# Altium schematic sheet C-metr_digital.SchDoc
size 500 x 350 mm
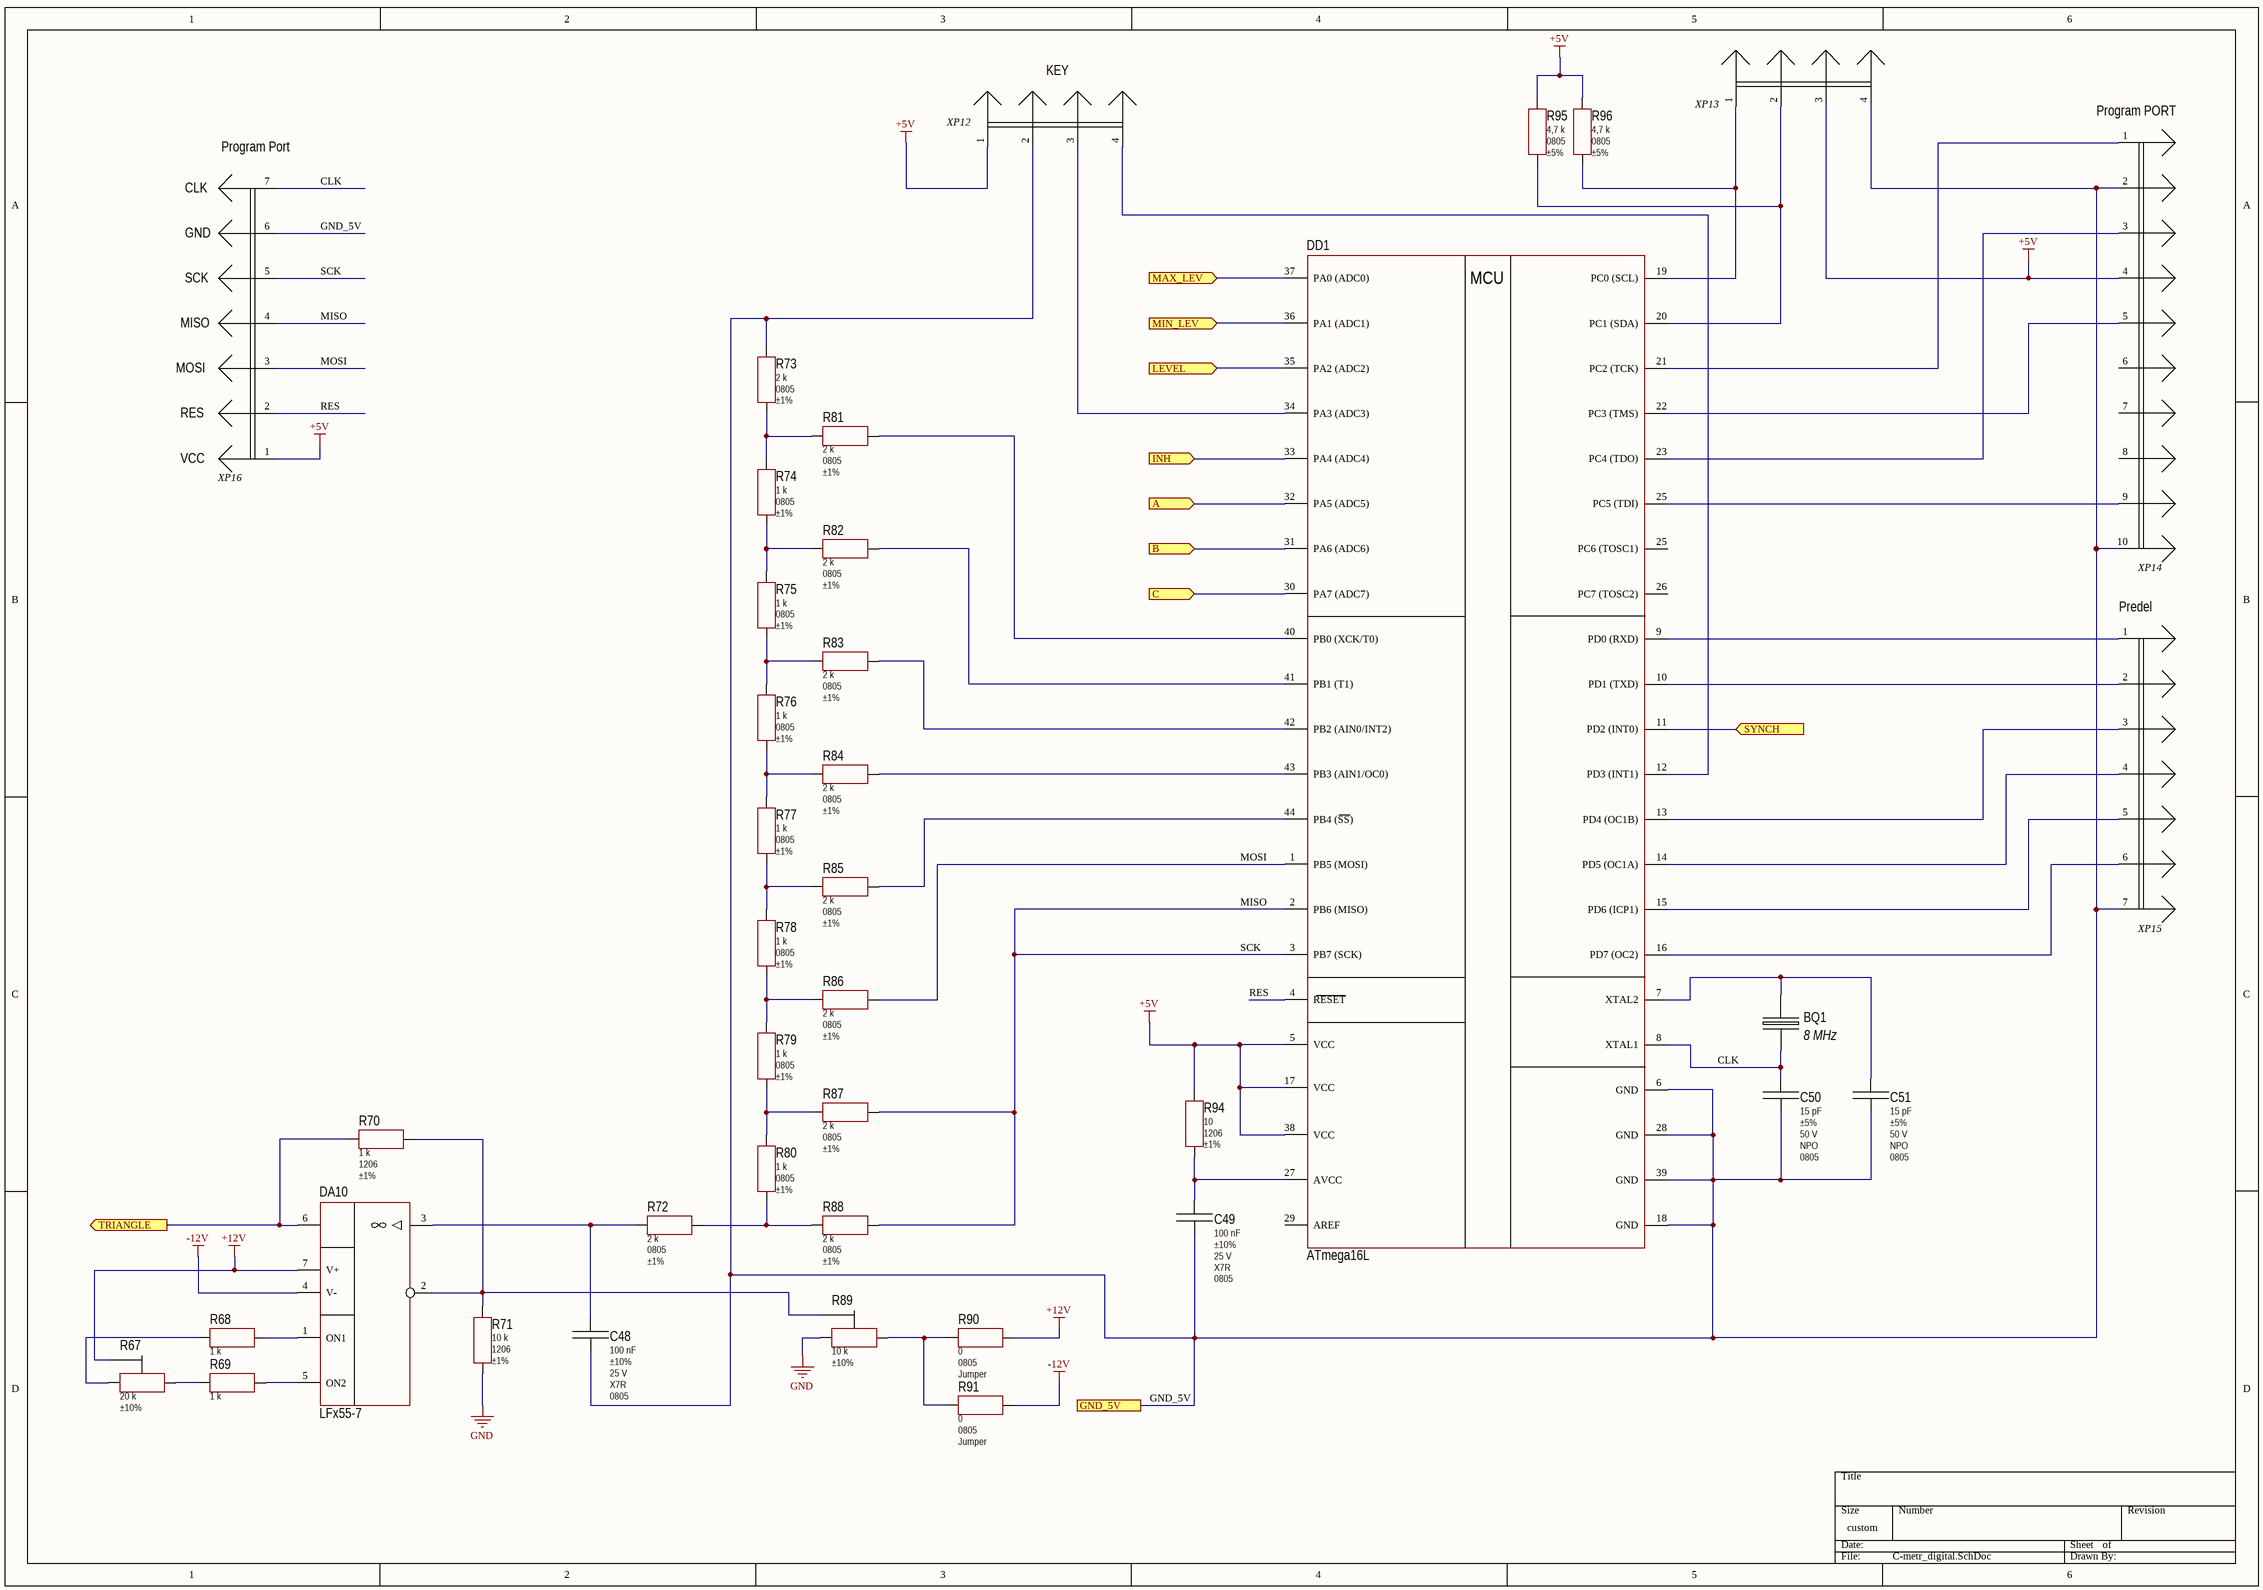
[diagram p0: C-metr_digital.SchDoc]

## Parts
BQ1  8 MHz  [HC-49/U3H]
C48  Tolerance: ±10%  Voltage: 25 V  Dielectric: X7R  Case: 0805  [C-0805-0.95]  (hidden comment: 100 nF)
C49  Tolerance: ±10%  Voltage: 25 V  Dielectric: X7R  Case: 0805  [C-0805-0.95]  (hidden comment: 100 nF)
C50  Tolerance: ±5%  Voltage: 50 V  Dielectric: NPO  Case: 0805  [C-0805-0.7]  (hidden comment: 15 pF)
C51  Tolerance: ±5%  Voltage: 50 V  Dielectric: NPO  Case: 0805  [C-0805-0.7]  (hidden comment: 15 pF)
DA10  LFx55-7  [DIP-8]
DD1  ATmega16L  [TQFP-44]
R67  Tolerance: ±10%  [3296W]  (hidden comment: 20 k)
R68  1 k  [R-1206]
R69  1 k  [R-1206]
R70  Case: 1206  Tolerance: ±1%  [R-1206]  (hidden comment: 1 k)
R71  Case: 1206  Tolerance: ±1%  [R-1206]  (hidden comment: 10 k)
R72  Case: 0805  Tolerance: ±1%  [R-0805]  (hidden comment: 2 k)
R73  Case: 0805  Tolerance: ±1%  [R-0805]  (hidden comment: 2 k)
R74  Case: 0805  Tolerance: ±1%  [R-0805]  (hidden comment: 1 k)
R75  Case: 0805  Tolerance: ±1%  [R-0805]  (hidden comment: 1 k)
R76  Case: 0805  Tolerance: ±1%  [R-0805]  (hidden comment: 1 k)
R77  Case: 0805  Tolerance: ±1%  [R-0805]  (hidden comment: 1 k)
R78  Case: 0805  Tolerance: ±1%  [R-0805]  (hidden comment: 1 k)
R79  Case: 0805  Tolerance: ±1%  [R-0805]  (hidden comment: 1 k)
R80  Case: 0805  Tolerance: ±1%  [R-0805]  (hidden comment: 1 k)
R81  Case: 0805  Tolerance: ±1%  [R-0805]  (hidden comment: 2 k)
R82  Case: 0805  Tolerance: ±1%  [R-0805]  (hidden comment: 2 k)
R83  Case: 0805  Tolerance: ±1%  [R-0805]  (hidden comment: 2 k)
R84  Case: 0805  Tolerance: ±1%  [R-0805]  (hidden comment: 2 k)
R85  Case: 0805  Tolerance: ±1%  [R-0805]  (hidden comment: 2 k)
R86  Case: 0805  Tolerance: ±1%  [R-0805]  (hidden comment: 2 k)
R87  Case: 0805  Tolerance: ±1%  [R-0805]  (hidden comment: 2 k)
R88  Case: 0805  Tolerance: ±1%  [R-0805]  (hidden comment: 2 k)
R89  Tolerance: ±10%  [3296W]  (hidden comment: 10 k)
R90  Case: 0805  Tolerance: Jumper  [R-0805]  (hidden comment: 0)
R91  Case: 0805  Tolerance: Jumper  [R-0805]  (hidden comment: 0)
R94  Case: 1206  Tolerance: ±1%  [R-1206]  (hidden comment: 10)
R95  Case: 0805  Tolerance: ±5%  [R-0805]  (hidden comment: 4,7 k)
R96  Case: 0805  Tolerance: ±5%  [R-0805]  (hidden comment: 4,7 k)
XP12  Text  [61300411121]  (value not drawn)
XP13  Text  [61300411121]  (value not drawn)
XP14  Text  [61201021621]  (value not drawn)
XP15  Text  [61300711121]  (value not drawn)
XP16  Text  [61300711121]  (value not drawn)

## Ports
A (in), B (in), C (in), GND_5V, INH (in), LEVEL (in), MAX_LEV (in), MIN_LEV (in), SYNCH (in), TRIANGLE (out)

## Nets
+5V: DD1.5(VCC) DD1.17(VCC) DD1.38(VCC) R94.2 R95.2 R96.2 XP12.1 XP13.3 XP14.4 XP16.1
+12V: DA10.7(V+) R67.2 R90.1
-12V: DA10.4(V-) R91.1
GND: R71.1 R89.3
A: DD1.32(PA5_(ADC5)) ; port A
B: DD1.31(PA6_(ADC6)) ; port B
C: DD1.30(PA7_(ADC7)) ; port C
CLK: BQ1.1 C50.2 DD1.8(XTAL1) XP16.7
GND_5V: C48.1 C49.1 C50.1 C51.1 DD1.6(GND) DD1.18(GND) DD1.28(GND) DD1.39(GND) R73.1 XP12.2 XP13.4 XP14.2 XP14.10 XP15.7 XP16.6 ; port GND_5V
INH: DD1.33(PA4_(ADC4)) ; port INH
LEVEL: DD1.35(PA2_(ADC2)) ; port LEVEL
MAX_LEV: DD1.37(PA0_(ADC0)) ; port MAX_LEV
MIN_LEV: DD1.36(PA1_(ADC1)) ; port MIN_LEV
MISO: DD1.2(PB6_(MISO)) DD1.3(PB7_(SCK)) R87.2 R88.2 XP16.4 XP16.5  [also labelled SCK]
MOSI: DD1.1(PB5_(MOSI)) R86.2 XP16.3
RES: DD1.4(RESET) XP16.2
SYNCH: DD1.11(PD2_(INT0)) ; port SYNCH
TRIANGLE: DA10.6(OUT) R70.1 ; port TRIANGLE
NetBQ1_2: BQ1.2 C51.2 DD1.7(XTAL2)
NetC48_2: C48.2 DA10.3(+IN) R72.1
NetC49_2: C49.2 DD1.27(AVCC) R94.1
NetDA10_1: DA10.1(ON1) R68.1
NetDA10_2: DA10.2(-IN) R70.2 R71.2 R89.2
NetDA10_5: DA10.5(ON2) R69.1
NetDD1_9: DD1.9(PD0_(RXD)) XP15.1
NetDD1_10: DD1.10(PD1_(TXD)) XP15.2
NetDD1_12: DD1.12(PD3_(INT1)) XP12.4
NetDD1_13: DD1.13(PD4_(OC1B)) XP15.3
NetDD1_14: DD1.14(PD5_(OC1A)) XP15.4
NetDD1_15: DD1.15(PD6_(ICP1)) XP15.5
NetDD1_16: DD1.16(PD7_(OC2)) XP15.6
NetDD1_19: DD1.19(PC0_(SCL)) R96.1 XP13.1
NetDD1_20: DD1.20(PC1_(SDA)) R95.1 XP13.2
NetDD1_21: DD1.21(PC2_(TCK)) XP14.1
NetDD1_22: DD1.22(PC3_(TMS)) XP14.5
NetDD1_23: DD1.23(PC4_(TDO)) XP14.3
NetDD1_25: DD1.25(PC6_(TOSC1)) XP14.9
NetDD1_34: DD1.34(PA3_(ADC3)) XP12.3
NetDD1_40: DD1.40(PB0_(XCK/T0)) R81.2
NetDD1_41: DD1.41(PB1_(T1)) R82.2
NetDD1_42: DD1.42(PB2_(AIN0/INT2)) R83.2
NetDD1_43: DD1.43(PB3_(AIN1/OC0)) R84.2
NetDD1_44: DD1.44(PB4_(SS)) R85.2
NetR67_1: R67.1 R69.2
NetR67_3: R67.3 R68.2
NetR72_2: R72.2 R80.1 R88.1
NetR73_2: R73.2 R74.2 R81.1
NetR74_1: R74.1 R75.2 R82.1
NetR75_1: R75.1 R76.2 R83.1
NetR76_1: R76.1 R77.2 R84.1
NetR77_1: R77.1 R78.2 R85.1
NetR78_1: R78.1 R79.2 R86.1
NetR79_1: R79.1 R80.2 R87.1
NetR89_1: R89.1 R90.2 R91.2

Not connected (* = marked no-connect by the designer): DD1 26(PC7_(TOSC2)) 29(AREF); XP14 6 7 8

## Notes on the sheet
- (near XP12) KEY
- (near XP14) Program PORT
- (near XP16) Program Port
- CLK
- SCK
- GND
- (near XP16) MISO
- MOSI
- VCC
- RES
- (near XP15) Predel
- (in symbol ATmega16L-8AU) MCU

## Library data of the parts
BQ1 = KX-3HT 8 MHz: Manufacturer: Geyer Electronic; Type: Кварцевый резонатор; Part Number: KX-3HT 8 MHz; Value: 8 MHz; Case: HC-49/U3H; Operating Temperature: −40°C ... 85°C
C48 C49 = CC0805KRX7R8BB104: Manufacturer: Yageo; Type: Конденсатор; Value: 100; CommentDOC: ( CC - 0805 - X7R - 25 V - 100 nF ±10% ); ValueSCH: 100 nF; Part Number: CC0805KRX7R8BB104; Units: nF; Operating Temperature: -55 ... 125 °C; Series: CC; Value+Units: 100 nF; ( Series - Case - Dielectric -  Voltage - Value+Units Tolerance: ( CC - 0805 - X7R - 25 V - 100 nF ±10% )
C50 C51 = CC0805JRNPO9BN150: Manufacturer: Yageo; Type: Конденсатор; Value: 15; CommentDOC: ( CC - 0805 - NPO - 50 V - 15 pF ±5% ); ValueSCH: 15 pF; Part Number: CC0805JRNPO9BN150; Units: pF; Operating Temperature: -55 ... 125 °C; Series: CC; Value+Units: 15 pF; ( Series - Case - Dielectric -  Voltage - Value+Units Tolerance: ( CC - 0805 - NPO - 50 V - 15 pF ±5% )
DA10 = LF357N: Part Number: LF357N; Manufacturer: STMicroelectronics; Bandwidth: 20 MHz; Voltage  Supply: ±22 V; Case: DIP-8; Operating Temperature: 0°С ... 70°С
DD1 = ATmega16L-8AU: Manufacturer: Microchip Technology; Operation Frequency: 16 MHz; Prog Interface: ISP/JTAG; Part Number: ATmega16L-8AU; Case: TQFP-44; Operating Temperature: -55°С ... 125°С
R67 = 3296W-1-203LF: Manufacturer: Bourns Inc.; Power: 0,5 W; Value: 20; Units: kOhm; Value+Units: 20 kOhm; CommentDOC: ( 3296W - 0,5 W - 20 kOhm ±10% ); Type: Резистор; ValueSCH: 20 k; Part Number: 3296W-1-203LF; Operating Temperature: -55°C … 125°C; Series: 3296W; ( Series - Power - Value+Units Tolerance ): ( 3296W - 0,5 W - 20 kOhm ±10% ); Value Units: 20 kOhm
R68 R69 = CRCW12061K00JNEA: Manufacturer: Vishay Dale; Functional Analog Manufacturer: Yageo; Tolerance: ±5%; Power: 0,25 W; Value: 1; Units: kOhm; Operating Voltage: 200 V; Value+Units: 1 kOhm; CommentDOC: ( CRCW - 1206 - 0,25 W - 1 kOhm  ±5% ); Functional Analog: RC1206JR-071KL; Type: Резистор; ValueSCH: 1 k; Case: 1206; Part Number: CRCW12061K00JNEA; Operating Temperature: -55°C ... 155°C; Series: CRCW
R70 = CRCW12061K00FKEA: Manufacturer: Vishay Dale; Functional Analog Manufacturer: Yageo; Power: 0,25 W; Value: 1; Units: kOhm; Operating Voltage: 200 V; Value+Units: 1 kOhm; CommentDOC: ( CRCW - 1206 - 0,25 W - 1 kOhm  ±1% ); Functional Analog: RC1206FR-071KL; Type: Резистор; ValueSCH: 1 k; Part Number: CRCW12061K00FKEA; Operating Temperature: -55°C ... 155°C; Series: CRCW
R71 = CRCW120610K0FKEA: Manufacturer: Vishay Dale; Functional Analog Manufacturer: Yageo; Power: 0,25 W; Value: 10; Units: kOhm; Operating Voltage: 200 V; Value+Units: 10 kOhm; CommentDOC: ( CRCW - 1206 - 0,25 W - 10 kOhm  ±1% ); Functional Analog: RC1206FR-0710KL; Type: Резистор; ValueSCH: 10 k; Part Number: CRCW120610K0FKEA; Operating Temperature: -55°C ... 155°C; Series: CRCW
R72 R73 R81-R88 = CRCW08052K00FKEA: Manufacturer: Vishay Dale; Functional Analog Manufacturer: Yageo; Power: 0,125 W; Value: 2; Units: kOhm; Operating Voltage: 150 V; Value+Units: 2 kOhm; CommentDOC: ( CRCW - 0805 - 0,125 W - 2 kOhm  ±1% ); Functional Analog: RC0805FR-072KL; Type: Резистор; ValueSCH: 2 k; Part Number: CRCW08052K00FKEA; Operating Temperature: -55°C ... 155°C; Series: CRCW
R74-R80 = CRCW08051K00FKEA: Manufacturer: Vishay Dale; Functional Analog Manufacturer: Yageo; Power: 0,125 W; Value: 1; Units: kOhm; Operating Voltage: 150 V; Value+Units: 1 kOhm; CommentDOC: ( CRCW - 0805 - 0,125 W - 1 kOhm  ±1% ); Functional Analog: RC0805FR-071KL; Type: Резистор; ValueSCH: 1 k; Part Number: CRCW08051K00FKEA; Operating Temperature: -55°C ... 155°C; Series: CRCW
R89 = 3296W-1-103LF: Manufacturer: Bourns Inc.; Power: 0,5 W; Value: 10; Units: kOhm; Value+Units: 10 kOhm; CommentDOC: ( 3296W - 0,5 W - 10 kOhm ±10% ); Type: Резистор; ValueSCH: 10 k; Part Number: 3296W-1-103LF; Operating Temperature: -55°C … 125°C; Series: 3296W; ( Series - Power - Value+Units Tolerance ): ( 3296W - 0,5 W - 10 kOhm ±10% ); Value Units: 10 kOhm
R90 R91 = CRCW08050000Z0EA: Manufacturer: Vishay Dale; Functional Analog Manufacturer: Yageo; Power: 0,125 W; Units: Ohm; Operating Voltage: 150 V; Value+Units: 0 Ohm; CommentDOC: ( CRCW - 0805 - 0,125 W - 0 Ohm  Jumper ); Functional Analog: RC0805JR-070RL; Type: Резистор; ValueSCH: 0; Part Number: CRCW08050000Z0EA; Value: 0; Operating Temperature: -55°C ... 155°C; Series: CRCW
R94 = CRCW120610R0FKEA: Manufacturer: Vishay Dale; Functional Analog Manufacturer: Yageo; Power: 0,25 W; Units: Ohm; Operating Voltage: 200 V; Value+Units: 10 Ohm; CommentDOC: ( CRCW - 1206 - 0,25 W - 10 Ohm  ±1% ); Functional Analog: RC1206FR-0710RL; Type: Резистор; ValueSCH: 10; Part Number: CRCW120610R0FKEA; Value: 10; Operating Temperature: -55°C ... 155°C; Series: CRCW
R95 R96 = CRCW08054K70JNEA: Manufacturer: Vishay Dale; Functional Analog Manufacturer: Yageo; Power: 0,125 W; Value: 4,7; Units: kOhm; Operating Voltage: 150 V; Value+Units: 4,7 kOhm; CommentDOC: ( CRCW - 0805 - 0,125 W - 4,7 kOhm  ±5% ); Functional Analog: RC0805JR-074K7L; Type: Резистор; ValueSCH: 4,7 k; Part Number: CRCW08054K70JNEA; Operating Temperature: -55°C ... 155°C; Series: CRCW
XP12 XP13 = 61300411121: Manufacturer: Würth Elektronik; Pitch: 2,54 mm; Functional Analog: PLS-4; Type: Вилка; Part Number: 61300411121; Series: WE-PHD; Number of Pins: 4; Operating Temperature: −40°C ... 105°C
XP14 = 61201021621: Manufacturer: Würth Elektronik; Pitch: 2,54 mm; Functional Analog: BH-10; Type: Вилка; Part Number: 61201021621; Series: WE-BHD; Number of Pins: 10; Operating Temperature: −40°C ... 125°C
XP15 XP16 = 61300711121: Manufacturer: Würth Elektronik; Pitch: 2,54 mm; Functional Analog: PLS-7; Type: Вилка; Part Number: 61300711121; Series: WE-PHD; Number of Pins: 7; Operating Temperature: −40°C ... 105°C